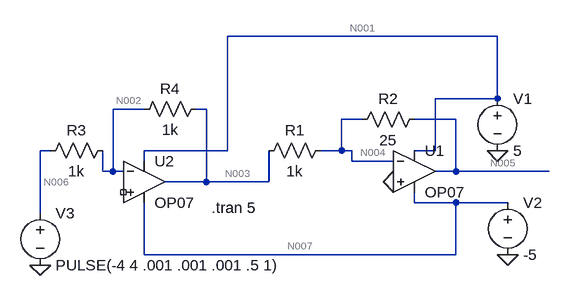
[diagram p0: schematic Draft7.asc]
Draft7.asc, the LTspice schematic file:
Version 4
SHEET 1 880 680
WIRE 288 -80 -128 -80
WIRE 288 16 288 -80
WIRE 288 16 192 16
WIRE -256 32 -304 32
WIRE -160 32 -176 32
WIRE 80 48 48 48
WIRE 224 48 160 48
WIRE -400 96 -416 96
WIRE -128 96 -128 -80
WIRE -128 96 -256 96
WIRE 48 96 48 48
WIRE 48 96 16 96
WIRE 64 96 48 96
WIRE 192 96 192 16
WIRE 192 96 160 96
WIRE -256 112 -256 96
WIRE 64 112 64 96
WIRE 128 112 64 112
WIRE -320 128 -320 96
WIRE -304 128 -304 32
WIRE -304 128 -320 128
WIRE -288 128 -304 128
WIRE 224 128 224 48
WIRE 224 128 192 128
WIRE 368 128 224 128
WIRE -160 144 -160 32
WIRE -160 144 -224 144
WIRE -64 144 -64 96
WIRE -64 144 -160 144
WIRE 160 176 160 160
WIRE 224 176 160 176
WIRE 304 176 224 176
WIRE -416 192 -416 96
WIRE -256 256 -256 176
WIRE 224 256 224 176
WIRE 224 256 -256 256
FLAG 288 96 0
FLAG 304 256 0
FLAG -416 272 0
FLAG 128 144 0
SYMBOL Opamps\\OP07 160 64 R0
SYMATTR InstName U1
SYMBOL voltage 288 0 R0
WINDOW 123 0 0 Left 2
WINDOW 39 0 0 Left 2
SYMATTR InstName V1
SYMATTR Value 5
SYMBOL voltage 304 160 R0
WINDOW 123 0 0 Left 2
WINDOW 39 0 0 Left 2
SYMATTR InstName V2
SYMATTR Value -5
SYMBOL voltage -416 176 R0
WINDOW 123 0 0 Left 2
WINDOW 39 0 0 Left 2
SYMATTR InstName V3
SYMATTR Value PULSE(-4 4 .001 .001 .001 .5 1)
SYMBOL res 176 32 R90
WINDOW 0 0 56 VBottom 2
WINDOW 3 32 56 VTop 2
SYMATTR InstName R2
SYMATTR Value 25
SYMBOL res 32 80 R90
WINDOW 0 0 56 VBottom 2
WINDOW 3 32 56 VTop 2
SYMATTR InstName R1
SYMATTR Value 1k
SYMBOL Opamps\\OP07 -256 80 R0
SYMATTR InstName U2
SYMBOL res -304 80 R90
WINDOW 0 0 56 VBottom 2
WINDOW 3 32 56 VTop 2
SYMATTR InstName R3
SYMATTR Value 1k
SYMBOL res -160 16 R90
WINDOW 0 0 56 VBottom 2
WINDOW 3 32 56 VTop 2
SYMATTR InstName R4
SYMATTR Value 1k
TEXT -152 184 Left 2 !.tran 5

The netlist it stands for:
* Draft7.asc
XU1 0 N004 N001 N007 N005 LT1001  ; OP07, pins In+ In- V+ V- OUT
V1 N001 0 5
V2 N007 0 -5
V3 N006 0 PULSE(-4 4 .001 .001 .001 .5 1)
R2 N005 N004 25
R1 N004 N003 1k
XU2 NC_01 N002 N001 N007 N003 LT1001  ; OP07, pins In+ In- V+ V- OUT
R3 N002 N006 1k
R4 N003 N002 1k
.tran 5
.lib LTC.lib
.backanno
.end

* Results of the author's LTspice run, read from the files saved beside the schematic
* Operating Point, zero values left out:
*   V(n004) = 296.9 nV
*   V(n001) = 5 V
*   V(n007) = -5 V
*   V(n005) = -94.41 mV
*   V(n006) = -4 V
*   V(n003) = 3.777 V
*   V(n002) = -111.7 mV
*   I(R4) = 3.888 mA
*   I(R3) = 3.888 mA
*   I(R1) = -3.777 mA
*   I(R2) = -3.777 mA
*   I(V3) = 3.888 mA
*   I(V2) = 4.584 mA
*   I(V1) = -8.472 mA
*   Ix(u1:3) = 757.9 µA
*   Ix(u1:4) = -4.534 mA
*   Ix(u1:5) = 3.777 mA
*   Ix(u2:3) = 7.714 mA
*   Ix(u2:4) = -49.52 µA
*   Ix(u2:5) = -7.665 mA
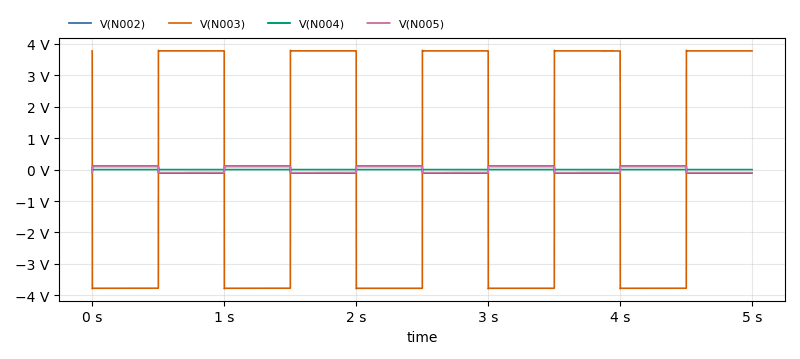
[diagram p1: Transient Analysis of Draft7.asc, plotted from the saved traces]
* Transient Analysis, 1 run:
*   V(N002): min -111.7 mV, max 111.9 mV, average 229.6 µV, rms 111.7 mV, last -111.7 mV
*   V(N003): min -3.793 V, max 3.793 V, average -7.541 mV, rms 3.774 V, last 3.777 V
*   V(N004): min -106.1 µV, max 104.9 µV, average -86.28 nV, rms 3.793 µV, last 295.7 nV
*   V(N005): min -94.83 mV, max 94.83 mV, average 188.4 µV, rms 94.36 mV, last -94.42 mV